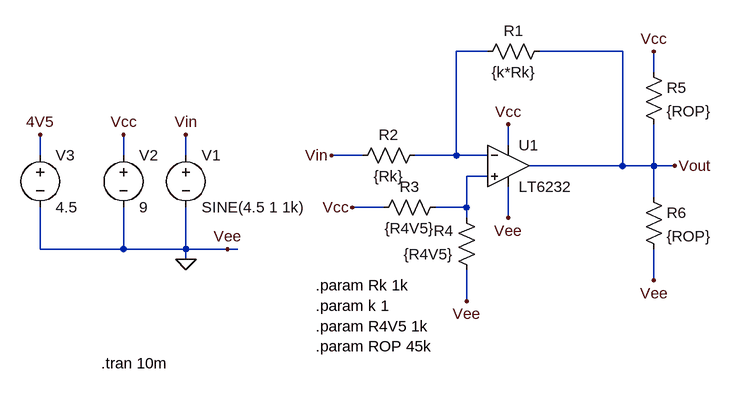
[diagram p0: schematic InverterOpTest.asc]
InverterOpTest.asc, the LTspice schematic file:
Version 4
SHEET 1 880 680
WIRE 128 32 80 32
WIRE 336 32 208 32
WIRE 384 64 384 32
WIRE 160 176 160 144
WIRE -560 192 -560 160
WIRE -432 192 -432 160
WIRE -336 192 -336 160
WIRE -64 192 -112 192
WIRE 80 192 80 32
WIRE 80 192 16 192
WIRE 128 192 80 192
WIRE 336 208 336 32
WIRE 336 208 192 208
WIRE 384 208 384 144
WIRE 384 208 336 208
WIRE 416 208 384 208
WIRE 128 224 96 224
WIRE 384 256 384 208
WIRE -32 272 -80 272
WIRE 96 272 96 224
WIRE 96 272 48 272
WIRE 96 288 96 272
WIRE 160 288 160 240
WIRE -560 336 -560 272
WIRE -432 336 -432 272
WIRE -432 336 -560 336
WIRE -336 336 -336 272
WIRE -336 336 -432 336
WIRE -272 336 -336 336
WIRE -256 336 -272 336
WIRE -336 352 -336 336
WIRE 384 384 384 336
WIRE 96 416 96 368
FLAG 160 144 Vcc
FLAG 160 288 Vee
FLAG -80 272 Vcc
FLAG 96 416 Vee
FLAG 416 208 Vout
FLAG -112 192 Vin
FLAG -336 352 0
FLAG -336 160 Vin
FLAG -272 336 Vee
FLAG -432 160 Vcc
FLAG 384 384 Vee
FLAG 384 32 Vcc
FLAG -560 160 4V5
SYMBOL Opamps\\LT6232 160 208 R0
SYMATTR InstName U1
SYMBOL res 112 48 R270
WINDOW 0 32 56 VTop 2
WINDOW 3 0 56 VBottom 2
SYMATTR InstName R1
SYMATTR Value {k*Rk}
SYMBOL res -80 208 R270
WINDOW 0 32 56 VTop 2
WINDOW 3 0 56 VBottom 2
SYMATTR InstName R2
SYMATTR Value {Rk}
SYMBOL res 64 256 R90
WINDOW 0 0 56 VBottom 2
WINDOW 3 32 56 VTop 2
SYMATTR InstName R3
SYMATTR Value {R4V5}
SYMBOL res 112 384 R180
WINDOW 0 36 76 Left 2
WINDOW 3 36 40 Left 2
SYMATTR InstName R4
SYMATTR Value {R4V5}
SYMBOL voltage -336 176 R0
WINDOW 123 0 0 Left 2
WINDOW 39 0 0 Left 2
SYMATTR InstName V1
SYMATTR Value SINE(4.5 1 1k)
SYMBOL voltage -432 176 R0
WINDOW 123 0 0 Left 2
WINDOW 39 0 0 Left 2
SYMATTR InstName V2
SYMATTR Value 9
SYMBOL res 368 48 R0
SYMATTR InstName R5
SYMATTR Value {ROP}
SYMBOL res 368 240 R0
SYMATTR InstName R6
SYMATTR Value {ROP}
SYMBOL voltage -560 176 R0
WINDOW 123 0 0 Left 2
WINDOW 39 0 0 Left 2
SYMATTR InstName V3
SYMATTR Value 4.5
TEXT -466 512 Left 2 !.tran 10m
TEXT -136 392 Left 2 !.param Rk 1k\n.param k 1\n.param R4V5 1k\n.param ROP 45k

The netlist it stands for:
* InverterOpTest.asc
* U1: LT6232 (symbol Opamps\LT6232 not available, pins judged from their places): In+=N002 In-=N001 V+=Vcc V-=0 OUT=Vout
R1 N001 Vout {k*Rk}
R2 Vin N001 {Rk}
R3 N002 Vcc {R4V5}
R4 0 N002 {R4V5}
V1 Vin 0 SINE(4.5 1 1k)
V2 Vcc 0 9
R5 Vcc Vout {ROP}
R6 Vout 0 {ROP}
V3 4V5 0 4.5
.tran 10m
.param Rk 1k
.param k 1
.param R4V5 1k
.param ROP 45k
.backanno
.end